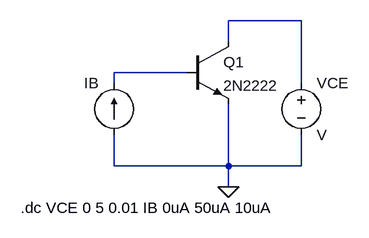
[diagram p0: schematic Draft1.asc]
Draft1.asc, the LTspice schematic file:
Version 4
SHEET 1 880 680
WIRE 384 16 272 16
WIRE 272 48 272 16
WIRE 208 96 96 96
WIRE 96 112 96 96
WIRE 384 112 384 16
WIRE 96 240 96 192
WIRE 272 240 272 144
WIRE 272 240 96 240
WIRE 384 240 384 192
WIRE 384 240 272 240
WIRE 272 272 272 240
FLAG 272 272 0
SYMBOL voltage 384 96 R0
SYMATTR InstName VCE
SYMBOL current 96 192 R180
WINDOW 0 24 80 Left 2
WINDOW 3 24 0 Left 2
WINDOW 123 0 0 Left 0
WINDOW 39 0 0 Left 0
SYMATTR InstName IB
SYMATTR Value ""
SYMBOL npn 208 48 R0
SYMATTR InstName Q1
SYMATTR Value 2N2222
TEXT -48 304 Left 2 !.dc VCE 0 5 0.01 IB 0uA 50uA 10uA

The netlist it stands for:
* Draft1.asc
VCE N001 0 V
IB 0 N002
Q1 N001 N002 0 0 2N2222
.model NPN NPN
.model PNP PNP
.lib standard.bjt
.dc VCE 0 5 0.01 IB 0uA 50uA 10uA
.backanno
.end